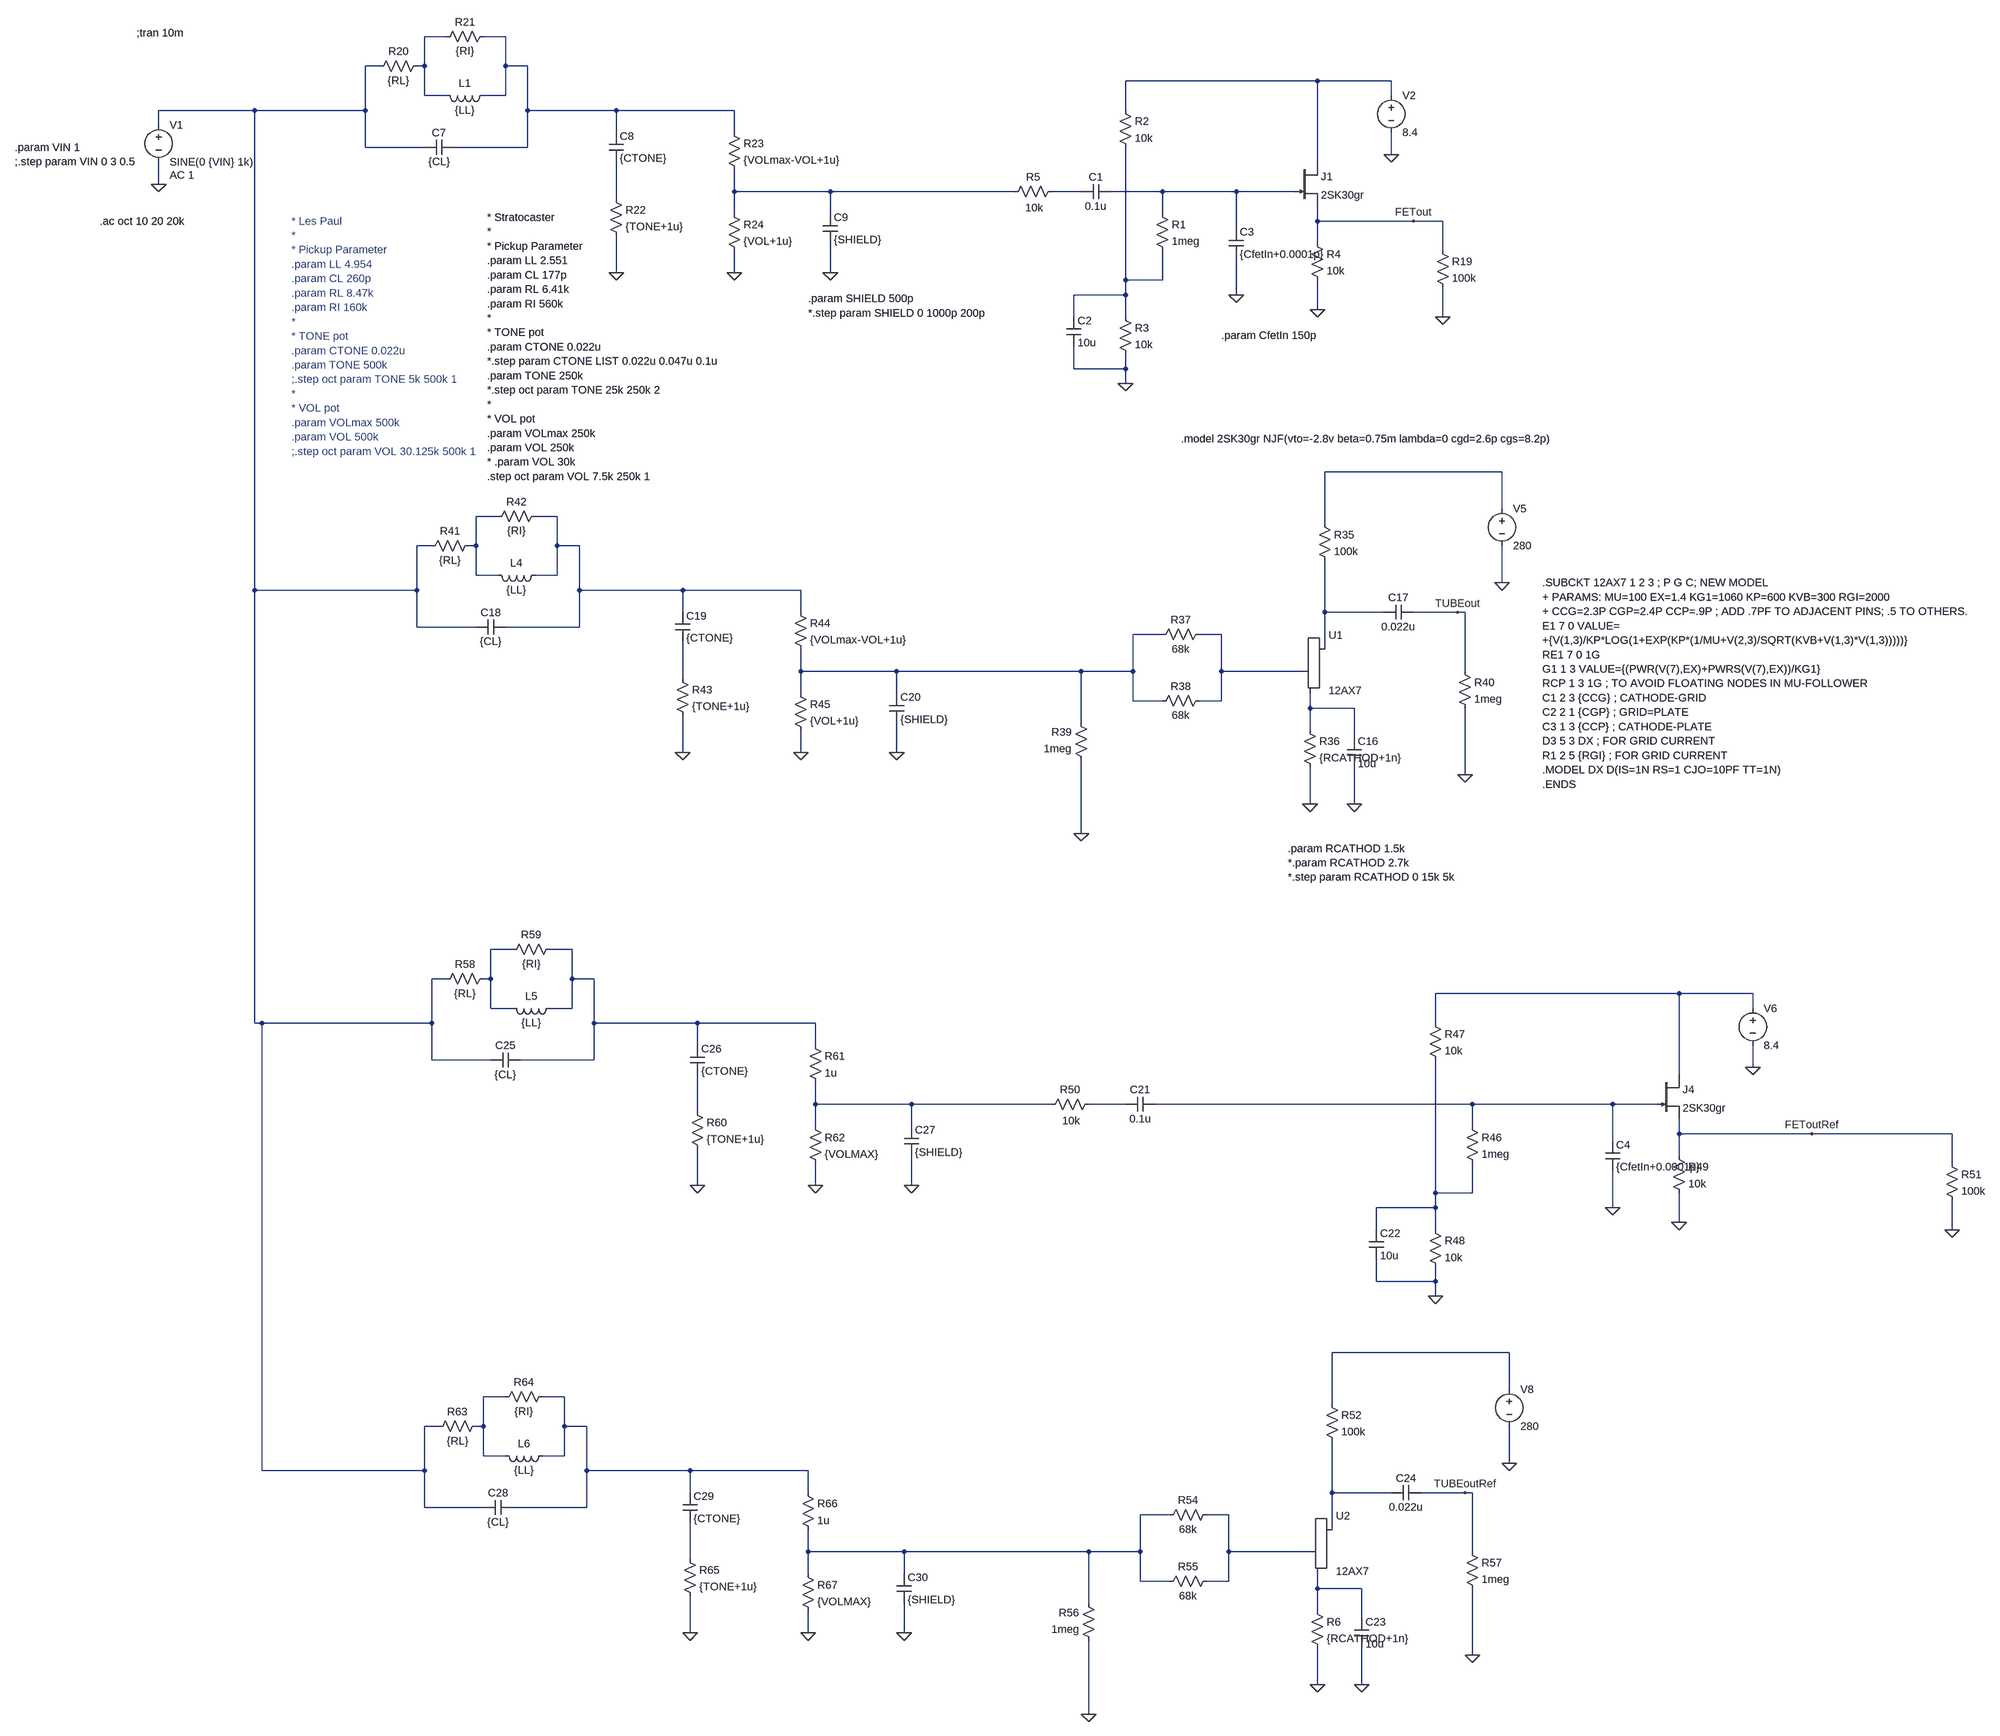
[diagram p0: schematic GuitarVOLvsBuffer.asc]
GuitarVOLvsBuffer.asc, the LTspice schematic file:
Version 4
SHEET 1 1708 5972
WIRE -2288 2032 -2336 2032
WIRE -2160 2032 -2208 2032
WIRE -2432 2096 -2464 2096
WIRE -2336 2096 -2336 2032
WIRE -2336 2096 -2352 2096
WIRE -2160 2096 -2160 2032
WIRE -2112 2096 -2160 2096
WIRE -400 2128 -816 2128
WIRE -240 2128 -400 2128
WIRE -2336 2160 -2336 2096
WIRE -2288 2160 -2336 2160
WIRE -2160 2160 -2160 2096
WIRE -2160 2160 -2208 2160
WIRE -240 2160 -240 2128
WIRE -2704 2192 -2912 2192
WIRE -2464 2192 -2464 2096
WIRE -2464 2192 -2704 2192
WIRE -2112 2192 -2112 2096
WIRE -1920 2192 -2112 2192
WIRE -1664 2192 -1920 2192
WIRE -816 2192 -816 2128
WIRE -2912 2224 -2912 2192
WIRE -1920 2240 -1920 2192
WIRE -1664 2240 -1664 2192
WIRE -2464 2272 -2464 2192
WIRE -2336 2272 -2464 2272
WIRE -2112 2272 -2112 2192
WIRE -2112 2272 -2272 2272
WIRE -240 2288 -240 2240
WIRE -400 2304 -400 2128
WIRE -2912 2352 -2912 2304
WIRE -1664 2368 -1664 2320
WIRE -1456 2368 -1664 2368
WIRE -1056 2368 -1456 2368
WIRE -912 2368 -976 2368
WIRE -736 2368 -848 2368
WIRE -576 2368 -736 2368
WIRE -448 2368 -576 2368
WIRE -1920 2384 -1920 2304
WIRE -1664 2416 -1664 2368
WIRE -1456 2416 -1456 2368
WIRE -736 2416 -736 2368
WIRE -400 2432 -400 2400
WIRE -192 2432 -400 2432
WIRE -128 2432 -192 2432
WIRE -576 2448 -576 2368
WIRE -400 2480 -400 2432
WIRE -128 2496 -128 2432
WIRE -1920 2544 -1920 2464
WIRE -1664 2544 -1664 2496
WIRE -1456 2544 -1456 2480
WIRE -816 2560 -816 2272
WIRE -736 2560 -736 2496
WIRE -736 2560 -816 2560
WIRE -816 2592 -816 2560
WIRE -816 2592 -928 2592
WIRE -576 2592 -576 2512
WIRE -400 2624 -400 2560
WIRE -928 2640 -928 2592
WIRE -816 2640 -816 2592
WIRE -128 2640 -128 2576
WIRE -928 2752 -928 2704
WIRE -816 2752 -816 2720
WIRE -816 2752 -928 2752
WIRE -816 2784 -816 2752
WIRE 0 2976 -384 2976
WIRE 0 3056 0 2976
WIRE -2176 3072 -2224 3072
WIRE -2048 3072 -2096 3072
WIRE -384 3088 -384 2976
WIRE -2320 3136 -2352 3136
WIRE -2224 3136 -2224 3072
WIRE -2224 3136 -2240 3136
WIRE -2048 3136 -2048 3072
WIRE -2000 3136 -2048 3136
WIRE -2224 3200 -2224 3136
WIRE -2176 3200 -2224 3200
WIRE -2048 3200 -2048 3136
WIRE -2048 3200 -2096 3200
WIRE 0 3216 0 3136
WIRE -2704 3232 -2704 2192
WIRE -2352 3232 -2352 3136
WIRE -2352 3232 -2704 3232
WIRE -2000 3232 -2000 3136
WIRE -1776 3232 -2000 3232
WIRE -1520 3232 -1776 3232
WIRE -1776 3280 -1776 3232
WIRE -1520 3280 -1520 3232
WIRE -384 3280 -384 3168
WIRE -256 3280 -384 3280
WIRE -96 3280 -192 3280
WIRE -80 3280 -96 3280
WIRE -2352 3312 -2352 3232
WIRE -2224 3312 -2352 3312
WIRE -2000 3312 -2000 3232
WIRE -2000 3312 -2160 3312
WIRE -736 3328 -800 3328
WIRE -608 3328 -656 3328
WIRE -384 3360 -384 3280
WIRE -1520 3408 -1520 3360
WIRE -1312 3408 -1520 3408
WIRE -912 3408 -1312 3408
WIRE -800 3408 -800 3328
WIRE -800 3408 -912 3408
WIRE -608 3408 -608 3328
WIRE -432 3408 -608 3408
WIRE -80 3408 -80 3280
WIRE -1776 3424 -1776 3344
WIRE -1520 3456 -1520 3408
WIRE -1312 3456 -1312 3408
WIRE -800 3472 -800 3408
WIRE -736 3472 -800 3472
WIRE -608 3472 -608 3408
WIRE -608 3472 -656 3472
WIRE -416 3488 -416 3456
WIRE -320 3488 -416 3488
WIRE -912 3520 -912 3408
WIRE -416 3536 -416 3488
WIRE -320 3552 -320 3488
WIRE -1776 3584 -1776 3504
WIRE -1520 3584 -1520 3536
WIRE -1312 3584 -1312 3520
WIRE -80 3632 -80 3488
WIRE -416 3696 -416 3616
WIRE -320 3696 -320 3616
WIRE -912 3760 -912 3600
WIRE -2144 4224 -2192 4224
WIRE -2016 4224 -2064 4224
WIRE -2288 4288 -2320 4288
WIRE -2192 4288 -2192 4224
WIRE -2192 4288 -2208 4288
WIRE -2016 4288 -2016 4224
WIRE -1968 4288 -2016 4288
WIRE 384 4320 -144 4320
WIRE 544 4320 384 4320
WIRE -2192 4352 -2192 4288
WIRE -2144 4352 -2192 4352
WIRE -2016 4352 -2016 4288
WIRE -2016 4352 -2064 4352
WIRE 544 4352 544 4320
WIRE -2704 4384 -2704 3232
WIRE -2688 4384 -2704 4384
WIRE -2320 4384 -2320 4288
WIRE -2320 4384 -2688 4384
WIRE -1968 4384 -1968 4288
WIRE -1744 4384 -1968 4384
WIRE -1488 4384 -1744 4384
WIRE -144 4384 -144 4320
WIRE -1744 4432 -1744 4384
WIRE -1488 4432 -1488 4384
WIRE -2320 4464 -2320 4384
WIRE -2192 4464 -2320 4464
WIRE -1968 4464 -1968 4384
WIRE -1968 4464 -2128 4464
WIRE 544 4480 544 4432
WIRE 384 4496 384 4320
WIRE -1488 4560 -1488 4512
WIRE -1280 4560 -1488 4560
WIRE -976 4560 -1280 4560
WIRE -816 4560 -896 4560
WIRE -64 4560 -752 4560
WIRE 240 4560 -64 4560
WIRE 336 4560 240 4560
WIRE -1744 4576 -1744 4496
WIRE -1488 4608 -1488 4560
WIRE -1280 4608 -1280 4560
WIRE -64 4608 -64 4560
WIRE 384 4624 384 4592
WIRE 672 4624 384 4624
WIRE 976 4624 672 4624
WIRE 240 4640 240 4560
WIRE 384 4672 384 4624
WIRE 976 4688 976 4624
WIRE -1744 4736 -1744 4656
WIRE -1488 4736 -1488 4688
WIRE -1280 4736 -1280 4672
WIRE -144 4752 -144 4464
WIRE -64 4752 -64 4688
WIRE -64 4752 -144 4752
WIRE -144 4784 -144 4752
WIRE -144 4784 -272 4784
WIRE 240 4784 240 4704
WIRE 384 4816 384 4752
WIRE -272 4832 -272 4784
WIRE -144 4832 -144 4784
WIRE 976 4832 976 4768
WIRE -272 4944 -272 4896
WIRE -144 4944 -144 4912
WIRE -144 4944 -272 4944
WIRE -144 4976 -144 4944
WIRE 16 5168 -368 5168
WIRE 16 5248 16 5168
WIRE -2160 5264 -2208 5264
WIRE -2032 5264 -2080 5264
WIRE -368 5280 -368 5168
WIRE -2304 5328 -2336 5328
WIRE -2208 5328 -2208 5264
WIRE -2208 5328 -2224 5328
WIRE -2032 5328 -2032 5264
WIRE -1984 5328 -2032 5328
WIRE -2208 5392 -2208 5328
WIRE -2160 5392 -2208 5392
WIRE -2032 5392 -2032 5328
WIRE -2032 5392 -2080 5392
WIRE 16 5408 16 5328
WIRE -2688 5424 -2688 4384
WIRE -2336 5424 -2336 5328
WIRE -2336 5424 -2688 5424
WIRE -1984 5424 -1984 5328
WIRE -1760 5424 -1984 5424
WIRE -1504 5424 -1760 5424
WIRE -1760 5472 -1760 5424
WIRE -1504 5472 -1504 5424
WIRE -368 5472 -368 5360
WIRE -240 5472 -368 5472
WIRE -80 5472 -176 5472
WIRE -64 5472 -80 5472
WIRE -2336 5504 -2336 5424
WIRE -2208 5504 -2336 5504
WIRE -1984 5504 -1984 5424
WIRE -1984 5504 -2144 5504
WIRE -720 5520 -784 5520
WIRE -592 5520 -640 5520
WIRE -368 5552 -368 5472
WIRE -1504 5600 -1504 5552
WIRE -1296 5600 -1504 5600
WIRE -896 5600 -1296 5600
WIRE -784 5600 -784 5520
WIRE -784 5600 -896 5600
WIRE -592 5600 -592 5520
WIRE -416 5600 -592 5600
WIRE -64 5600 -64 5472
WIRE -1760 5616 -1760 5536
WIRE -1504 5648 -1504 5600
WIRE -1296 5648 -1296 5600
WIRE -784 5664 -784 5600
WIRE -720 5664 -784 5664
WIRE -592 5664 -592 5600
WIRE -592 5664 -640 5664
WIRE -400 5680 -400 5648
WIRE -304 5680 -400 5680
WIRE -896 5712 -896 5600
WIRE -400 5728 -400 5680
WIRE -304 5744 -304 5680
WIRE -1760 5776 -1760 5696
WIRE -1504 5776 -1504 5728
WIRE -1296 5776 -1296 5712
WIRE -64 5824 -64 5680
WIRE -400 5888 -400 5808
WIRE -304 5888 -304 5808
WIRE -896 5952 -896 5792
FLAG -400 2624 0
FLAG -816 2784 0
FLAG -240 2288 0
FLAG -128 2640 0
FLAG -2912 2352 0
FLAG 0 3216 0
FLAG -80 3632 0
FLAG -912 3760 0
FLAG -416 3696 0
FLAG -320 3696 0
FLAG -1920 2544 0
FLAG -1664 2544 0
FLAG -1456 2544 0
FLAG -1776 3584 0
FLAG -1520 3584 0
FLAG -1312 3584 0
FLAG 384 4816 0
FLAG -144 4976 0
FLAG 544 4480 0
FLAG 976 4832 0
FLAG 16 5408 0
FLAG -64 5824 0
FLAG -896 5952 0
FLAG -400 5888 0
FLAG -304 5888 0
FLAG -1744 4736 0
FLAG -1488 4736 0
FLAG -1280 4736 0
FLAG -1760 5776 0
FLAG -1504 5776 0
FLAG -1296 5776 0
FLAG -192 2432 FETout
FLAG 672 4624 FEToutRef
FLAG -96 3280 TUBEout
FLAG -80 5472 TUBEoutRef
FLAG -576 2592 0
FLAG 240 4784 0
SYMBOL njf -448 2304 R0
SYMATTR InstName J1
SYMATTR Value 2SK30gr
SYMBOL res -752 2400 R0
SYMATTR InstName R1
SYMATTR Value 1meg
SYMBOL res -832 2176 R0
SYMATTR InstName R2
SYMATTR Value 10k
SYMBOL res -832 2624 R0
SYMATTR InstName R3
SYMATTR Value 10k
SYMBOL res -416 2464 R0
SYMATTR InstName R4
SYMATTR Value 10k
SYMBOL res -960 2352 R90
WINDOW 0 0 56 VBottom 2
WINDOW 3 36 54 VTop 2
SYMATTR InstName R5
SYMATTR Value 10k
SYMBOL voltage -240 2144 R0
WINDOW 123 0 0 Left 2
WINDOW 39 0 0 Left 2
SYMATTR InstName V2
SYMATTR Value 8.4
SYMBOL cap -848 2352 R90
WINDOW 0 0 32 VBottom 2
WINDOW 3 32 32 VTop 2
SYMATTR InstName C1
SYMATTR Value 0.1u
SYMBOL cap -944 2640 R0
SYMATTR InstName C2
SYMATTR Value 10u
SYMBOL res -144 2480 R0
SYMATTR InstName R19
SYMATTR Value 100k
SYMBOL voltage -2912 2208 R0
WINDOW 123 24 124 Left 2
WINDOW 39 0 0 Left 2
SYMATTR Value2 AC 1
SYMATTR InstName V1
SYMATTR Value SINE(0 {VIN} 1k)
SYMBOL Misc\\triode -384 3408 R0
SYMATTR InstName U1
SYMATTR Value 12AX7
SYMBOL res -400 3072 R0
SYMATTR InstName R35
SYMATTR Value 100k
SYMBOL res -432 3520 R0
SYMATTR InstName R36
SYMATTR Value {RCATHOD+1n}
SYMBOL cap -336 3552 R0
SYMATTR InstName C16
SYMATTR Value 10u
SYMBOL res -640 3312 R90
WINDOW 0 0 56 VBottom 2
WINDOW 3 32 56 VTop 2
SYMATTR InstName R37
SYMATTR Value 68k
SYMBOL res -640 3456 R90
WINDOW 0 0 56 VBottom 2
WINDOW 3 32 56 VTop 2
SYMATTR InstName R38
SYMATTR Value 68k
SYMBOL res -896 3616 R180
WINDOW 0 36 76 Left 2
WINDOW 3 36 40 Left 2
SYMATTR InstName R39
SYMATTR Value 1meg
SYMBOL voltage 0 3040 R0
WINDOW 123 0 0 Left 2
WINDOW 39 0 0 Left 2
SYMATTR InstName V5
SYMATTR Value 280
SYMBOL cap -192 3264 R90
WINDOW 0 0 32 VBottom 2
WINDOW 3 32 32 VTop 2
SYMATTR InstName C17
SYMATTR Value 0.022u
SYMBOL res -96 3392 R0
SYMATTR InstName R40
SYMATTR Value 1meg
SYMBOL res -2336 2080 R90
WINDOW 0 0 56 VBottom 2
WINDOW 3 32 56 VTop 2
SYMATTR InstName R20
SYMATTR Value {RL}
SYMBOL res -2192 2016 R90
WINDOW 0 0 56 VBottom 2
WINDOW 3 32 56 VTop 2
SYMATTR InstName R21
SYMATTR Value {RI}
SYMBOL ind -2192 2144 R90
WINDOW 0 5 56 VBottom 2
WINDOW 3 32 56 VTop 2
SYMATTR InstName L1
SYMATTR Value {LL}
SYMBOL cap -2272 2256 R90
WINDOW 0 0 32 VBottom 2
WINDOW 3 32 32 VTop 2
SYMATTR InstName C7
SYMATTR Value {CL}
SYMBOL res -1936 2368 R0
SYMATTR InstName R22
SYMATTR Value {TONE+1u}
SYMBOL cap -1936 2240 R0
SYMATTR InstName C8
SYMATTR Value {CTONE}
SYMBOL res -1680 2224 R0
SYMATTR InstName R23
SYMATTR Value {VOLmax-VOL+1u}
SYMBOL res -1680 2400 R0
SYMATTR InstName R24
SYMATTR Value {VOL+1u}
SYMBOL cap -1472 2416 R0
SYMATTR InstName C9
SYMATTR Value {SHIELD}
SYMBOL res -2224 3120 R90
WINDOW 0 0 56 VBottom 2
WINDOW 3 32 56 VTop 2
SYMATTR InstName R41
SYMATTR Value {RL}
SYMBOL res -2080 3056 R90
WINDOW 0 0 56 VBottom 2
WINDOW 3 32 56 VTop 2
SYMATTR InstName R42
SYMATTR Value {RI}
SYMBOL ind -2080 3184 R90
WINDOW 0 5 56 VBottom 2
WINDOW 3 32 56 VTop 2
SYMATTR InstName L4
SYMATTR Value {LL}
SYMBOL cap -2160 3296 R90
WINDOW 0 0 32 VBottom 2
WINDOW 3 32 32 VTop 2
SYMATTR InstName C18
SYMATTR Value {CL}
SYMBOL res -1792 3408 R0
SYMATTR InstName R43
SYMATTR Value {TONE+1u}
SYMBOL cap -1792 3280 R0
SYMATTR InstName C19
SYMATTR Value {CTONE}
SYMBOL res -1536 3264 R0
SYMATTR InstName R44
SYMATTR Value {VOLmax-VOL+1u}
SYMBOL res -1536 3440 R0
SYMATTR InstName R45
SYMATTR Value {VOL+1u}
SYMBOL cap -1328 3456 R0
SYMATTR InstName C20
SYMATTR Value {SHIELD}
SYMBOL njf 336 4496 R0
SYMATTR InstName J4
SYMATTR Value 2SK30gr
SYMBOL res -80 4592 R0
SYMATTR InstName R46
SYMATTR Value 1meg
SYMBOL res -160 4368 R0
SYMATTR InstName R47
SYMATTR Value 10k
SYMBOL res -160 4816 R0
SYMATTR InstName R48
SYMATTR Value 10k
SYMBOL res 368 4656 R0
SYMATTR InstName R49
SYMATTR Value 10k
SYMBOL res -880 4544 R90
WINDOW 0 0 56 VBottom 2
WINDOW 3 36 54 VTop 2
SYMATTR InstName R50
SYMATTR Value 10k
SYMBOL voltage 544 4336 R0
WINDOW 123 0 0 Left 2
WINDOW 39 0 0 Left 2
SYMATTR InstName V6
SYMATTR Value 8.4
SYMBOL cap -752 4544 R90
WINDOW 0 0 32 VBottom 2
WINDOW 3 32 32 VTop 2
SYMATTR InstName C21
SYMATTR Value 0.1u
SYMBOL cap -288 4832 R0
SYMATTR InstName C22
SYMATTR Value 10u
SYMBOL res 960 4672 R0
SYMATTR InstName R51
SYMATTR Value 100k
SYMBOL Misc\\triode -368 5600 R0
SYMATTR InstName U2
SYMATTR Value 12AX7
SYMBOL res -384 5264 R0
SYMATTR InstName R52
SYMATTR Value 100k
SYMBOL cap -320 5744 R0
SYMATTR InstName C23
SYMATTR Value 10u
SYMBOL res -624 5504 R90
WINDOW 0 0 56 VBottom 2
WINDOW 3 32 56 VTop 2
SYMATTR InstName R54
SYMATTR Value 68k
SYMBOL res -624 5648 R90
WINDOW 0 0 56 VBottom 2
WINDOW 3 32 56 VTop 2
SYMATTR InstName R55
SYMATTR Value 68k
SYMBOL res -880 5808 R180
WINDOW 0 36 76 Left 2
WINDOW 3 36 40 Left 2
SYMATTR InstName R56
SYMATTR Value 1meg
SYMBOL voltage 16 5232 R0
WINDOW 123 0 0 Left 2
WINDOW 39 0 0 Left 2
SYMATTR InstName V8
SYMATTR Value 280
SYMBOL cap -176 5456 R90
WINDOW 0 0 32 VBottom 2
WINDOW 3 32 32 VTop 2
SYMATTR InstName C24
SYMATTR Value 0.022u
SYMBOL res -80 5584 R0
SYMATTR InstName R57
SYMATTR Value 1meg
SYMBOL res -2192 4272 R90
WINDOW 0 0 56 VBottom 2
WINDOW 3 32 56 VTop 2
SYMATTR InstName R58
SYMATTR Value {RL}
SYMBOL res -2048 4208 R90
WINDOW 0 0 56 VBottom 2
WINDOW 3 32 56 VTop 2
SYMATTR InstName R59
SYMATTR Value {RI}
SYMBOL ind -2048 4336 R90
WINDOW 0 5 56 VBottom 2
WINDOW 3 32 56 VTop 2
SYMATTR InstName L5
SYMATTR Value {LL}
SYMBOL cap -2128 4448 R90
WINDOW 0 0 32 VBottom 2
WINDOW 3 32 32 VTop 2
SYMATTR InstName C25
SYMATTR Value {CL}
SYMBOL res -1760 4560 R0
SYMATTR InstName R60
SYMATTR Value {TONE+1u}
SYMBOL cap -1760 4432 R0
SYMATTR InstName C26
SYMATTR Value {CTONE}
SYMBOL res -1504 4416 R0
SYMATTR InstName R61
SYMATTR Value 1u
SYMBOL res -1504 4592 R0
SYMATTR InstName R62
SYMATTR Value {VOLMAX}
SYMBOL cap -1296 4608 R0
SYMATTR InstName C27
SYMATTR Value {SHIELD}
SYMBOL res -2208 5312 R90
WINDOW 0 0 56 VBottom 2
WINDOW 3 32 56 VTop 2
SYMATTR InstName R63
SYMATTR Value {RL}
SYMBOL res -2064 5248 R90
WINDOW 0 0 56 VBottom 2
WINDOW 3 32 56 VTop 2
SYMATTR InstName R64
SYMATTR Value {RI}
SYMBOL ind -2064 5376 R90
WINDOW 0 5 56 VBottom 2
WINDOW 3 32 56 VTop 2
SYMATTR InstName L6
SYMATTR Value {LL}
SYMBOL cap -2144 5488 R90
WINDOW 0 0 32 VBottom 2
WINDOW 3 32 32 VTop 2
SYMATTR InstName C28
SYMATTR Value {CL}
SYMBOL res -1776 5600 R0
SYMATTR InstName R65
SYMATTR Value {TONE+1u}
SYMBOL cap -1776 5472 R0
SYMATTR InstName C29
SYMATTR Value {CTONE}
SYMBOL res -1520 5456 R0
SYMATTR InstName R66
SYMATTR Value 1u
SYMBOL res -1520 5632 R0
SYMATTR InstName R67
SYMATTR Value {VOLMAX}
SYMBOL cap -1312 5648 R0
SYMATTR InstName C30
SYMATTR Value {SHIELD}
SYMBOL cap -592 2448 R0
SYMATTR InstName C3
SYMATTR Value {CfetIn+0.0001p}
SYMBOL cap 224 4640 R0
SYMATTR InstName C4
SYMATTR Value {CfetIn+0.0001p}
SYMBOL res -416 5712 R0
SYMATTR InstName R6
SYMATTR Value {RCATHOD+1n}
TEXT -696 2904 Left 2 !.model 2SK30gr NJF(vto=-2.8v beta=0.75m lambda=0 cgd=2.6p cgs=8.2p)
TEXT -3040 2432 Left 2 !.ac oct 10 20 20k
TEXT 88 3216 Left 2 !.SUBCKT 12AX7 1 2 3 ; P G C; NEW MODEL\n+ PARAMS: MU=100 EX=1.4 KG1=1060 KP=600 KVB=300 RGI=2000\n+ CCG=2.3P CGP=2.4P CCP=.9P ; ADD .7PF TO ADJACENT PINS; .5 TO OTHERS.\nE1 7 0 VALUE=\n+{V(1,3)/KP*LOG(1+EXP(KP*(1/MU+V(2,3)/SQRT(KVB+V(1,3)*V(1,3)))))}\nRE1 7 0 1G\nG1 1 3 VALUE={(PWR(V(7),EX)+PWRS(V(7),EX))/KG1}\nRCP 1 3 1G ; TO AVOID FLOATING NODES IN MU-FOLLOWER\nC1 2 3 {CCG} ; CATHODE-GRID\nC2 2 1 {CGP} ; GRID=PLATE\nC3 1 3 {CCP} ; CATHODE-PLATE\nD3 5 3 DX ; FOR GRID CURRENT\nR1 2 5 {RGI} ; FOR GRID CURRENT\n.MODEL DX D(IS=1N RS=1 CJO=10PF TT=1N)\n.ENDS
TEXT -1504 2600 Left 2 !.param SHIELD 500p\n*.step param SHIELD 0 1000p 200p
TEXT -2200 2424 Left 2 !* Stratocaster\n*\n* Pickup Parameter\n.param LL 2.551\n.param CL 177p\n.param RL 6.41k\n.param RI 560k\n*\n* TONE pot\n.param CTONE 0.022u\n*.step param CTONE LIST 0.022u 0.047u 0.1u\n.param TONE 250k\n*.step oct param TONE 25k 250k 2\n*\n* VOL pot\n.param VOLmax 250k\n.param VOL 250k\n* .param VOL 30k\n.step oct param VOL 7.5k 250k 1
TEXT -2624 2432 Left 2 ;* Les Paul\n*\n* Pickup Parameter\n.param LL 4.954\n.param CL 260p\n.param RL 8.47k\n.param RI 160k\n*\n* TONE pot\n.param CTONE 0.022u\n.param TONE 500k\n;.step oct param TONE 5k 500k 1\n*\n* VOL pot\n.param VOLmax 500k\n.param VOL 500k\n;.step oct param VOL 30.125k 500k 1
TEXT -608 2680 Left 2 !.param CfetIn 150p
TEXT -2960 2024 Left 2 !;tran 10m
TEXT -464 3792 Left 2 !.param RCATHOD 1.5k\n*.param RCATHOD 2.7k\n*.step param RCATHOD 0 15k 5k
TEXT -3224 2272 Left 2 !.param VIN 1\n;.step param VIN 0 3 0.5

The netlist it stands for:
* GuitarVOLvsBuffer.asc
J1 N004 N007 FETout 2SK30gr
R1 N007 N009 1meg
R2 N004 N009 10k
R3 N009 0 10k
R4 FETout 0 10k
R5 N006 N005 10k
V2 N004 0 8.4
C1 N007 N006 0.1u
C2 N009 0 10u
R19 FETout 0 100k
V1 N003 0 SINE(0 {VIN} 1k) AC 1
XU1 N013 N015 N017 12AX7
R35 N010 N013 100k
R36 N017 0 {RCATHOD+1n}
C16 N017 0 10u
R37 N015 N014 68k
R38 N015 N014 68k
R39 0 N014 1meg
V5 N010 0 280
C17 TUBEout N013 0.022u
R40 TUBEout 0 1meg
R20 N001 N003 {RL}
R21 N002 N001 {RI}
L1 N002 N001 {LL}
C7 N002 N003 {CL}
R22 N008 0 {TONE+1u}
C8 N002 N008 {CTONE}
R23 N002 N005 {VOLmax-VOL+1u}
R24 N005 0 {VOL+1u}
C9 N005 0 {SHIELD}
R41 N011 N003 {RL}
R42 N012 N011 {RI}
L4 N012 N011 {LL}
C18 N012 N003 {CL}
R43 N016 0 {TONE+1u}
C19 N012 N016 {CTONE}
R44 N012 N014 {VOLmax-VOL+1u}
R45 N014 0 {VOL+1u}
C20 N014 0 {SHIELD}
J4 N020 N023 FEToutRef 2SK30gr
R46 N023 N025 1meg
R47 N020 N025 10k
R48 N025 0 10k
R49 FEToutRef 0 10k
R50 N022 N021 10k
V6 N020 0 8.4
C21 N023 N022 0.1u
C22 N025 0 10u
R51 FEToutRef 0 100k
XU2 N029 N031 N033 12AX7
R52 N026 N029 100k
C23 N033 0 10u
R54 N031 N030 68k
R55 N031 N030 68k
R56 0 N030 1meg
V8 N026 0 280
C24 TUBEoutRef N029 0.022u
R57 TUBEoutRef 0 1meg
R58 N018 N003 {RL}
R59 N019 N018 {RI}
L5 N019 N018 {LL}
C25 N019 N003 {CL}
R60 N024 0 {TONE+1u}
C26 N019 N024 {CTONE}
R61 N019 N021 1u
R62 N021 0 {VOLMAX}
C27 N021 0 {SHIELD}
R63 N027 N003 {RL}
R64 N028 N027 {RI}
L6 N028 N027 {LL}
C28 N028 N003 {CL}
R65 N032 0 {TONE+1u}
C29 N028 N032 {CTONE}
R66 N028 N030 1u
R67 N030 0 {VOLMAX}
C30 N030 0 {SHIELD}
C3 N007 0 {CfetIn+0.0001p}
C4 N023 0 {CfetIn+0.0001p}
R6 N033 0 {RCATHOD+1n}
.model NJF NJF
.model PJF PJF
.lib standard.jft
.model 2SK30gr NJF(vto=-2.8v beta=0.75m lambda=0 cgd=2.6p cgs=8.2p)
.ac oct 10 20 20k
.SUBCKT 12AX7 1 2 3 ; P G C; NEW MODEL
+ PARAMS: MU=100 EX=1.4 KG1=1060 KP=600 KVB=300 RGI=2000
+ CCG=2.3P CGP=2.4P CCP=.9P ; ADD .7PF TO ADJACENT PINS; .5 TO OTHERS.
E1 7 0 VALUE=
+{V(1,3)/KP*LOG(1+EXP(KP*(1/MU+V(2,3)/SQRT(KVB+V(1,3)*V(1,3)))))}
RE1 7 0 1G
G1 1 3 VALUE={(PWR(V(7),EX)+PWRS(V(7),EX))/KG1}
RCP 1 3 1G ; TO AVOID FLOATING NODES IN MU-FOLLOWER
C1 2 3 {CCG} ; CATHODE-GRID
C2 2 1 {CGP} ; GRID=PLATE
C3 1 3 {CCP} ; CATHODE-PLATE
D3 5 3 DX ; FOR GRID CURRENT
R1 2 5 {RGI} ; FOR GRID CURRENT
.MODEL DX D(IS=1N RS=1 CJO=10PF TT=1N)
.ENDS
.param SHIELD 500p
*.step param SHIELD 0 1000p 200p
* Stratocaster
*
* Pickup Parameter
.param LL 2.551
.param CL 177p
.param RL 6.41k
.param RI 560k
*
* TONE pot
.param CTONE 0.022u
*.step param CTONE LIST 0.022u 0.047u 0.1u
.param TONE 250k
*.step oct param TONE 25k 250k 2
*
* VOL pot
.param VOLmax 250k
.param VOL 250k
* .param VOL 30k
.step oct param VOL 7.5k 250k 1
* * Les Paul
* *
* * Pickup Parameter
* .param LL 4.954
* .param CL 260p
* .param RL 8.47k
* .param RI 160k
* *
* * TONE pot
* .param CTONE 0.022u
* .param TONE 500k
* ;.step oct param TONE 5k 500k 1
* *
* * VOL pot
* .param VOLmax 500k
* .param VOL 500k
* ;.step oct param VOL 30.125k 500k 1
.param CfetIn 150p
;tran 10m
.param RCATHOD 1.5k
*.param RCATHOD 2.7k
*.step param RCATHOD 0 15k 5k
.param VIN 1
;.step param VIN 0 3 0.5
.backanno
.end